# Altium schematic sheet triboard-tc3x7-extension.SchDoc: Extension Board for TriBoard TC3X7 V2.0
size A4 portrait; DrawnBy: Dwayne Herzberg; Revision: V0.1; SheetNumber: 1; SheetTotal: 1
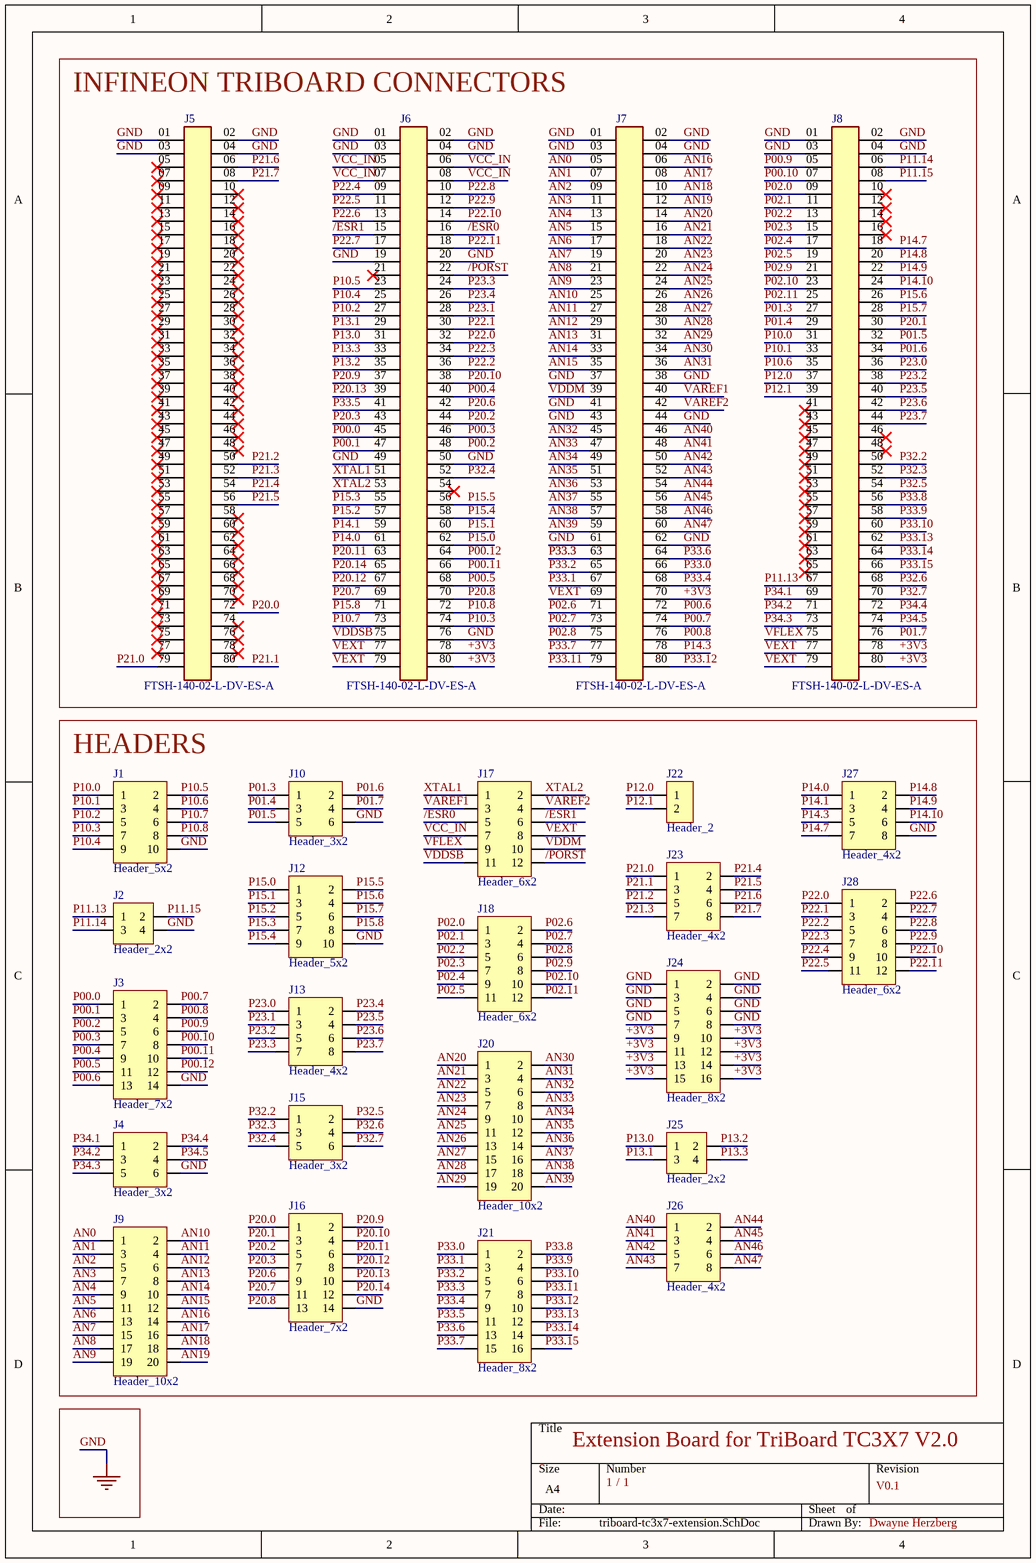
[diagram p0: triboard-tc3x7-extension.SchDoc]

## Parts
J1  Header_5x2  [header_5x2]
J2  Header_2x2  [Header_2x2]
J3  Header_7x2  [header_7x2]
J4  Header_3x2  [Header_3x2]
J5  FTSH-140-02-L-DV-ES-A  [SAMTEC_FTSH-140-XX-XXX-DV-ES-A]
J6  FTSH-140-02-L-DV-ES-A  [SAMTEC_FTSH-140-XX-XXX-DV-ES-A]
J7  FTSH-140-02-L-DV-ES-A  [SAMTEC_FTSH-140-XX-XXX-DV-ES-A]
J8  FTSH-140-02-L-DV-ES-A  [SAMTEC_FTSH-140-XX-XXX-DV-ES-A]
J9  Header_10x2  [Header_10x2]
J10  Header_3x2  [Header_3x2]
J12  Header_5x2  [header_5x2]
J13  Header_4x2  [header_4x2]
J15  Header_3x2  [Header_3x2]
J16  Header_7x2  [header_7x2]
J17  Header_6x2  [header_6x2]
J18  Header_6x2  [header_6x2]
J20  Header_10x2  [Header_10x2]
J21  Header_8x2  [header_8x2]
J22  Header_2  [HEADER_2]
J23  Header_4x2  [header_4x2]
J24  Header_8x2  [header_8x2]
J25  Header_2x2  [Header_2x2]
J26  Header_4x2  [header_4x2]
J27  Header_4x2  [header_4x2]
J28  Header_6x2  [header_6x2]

## Blocks framed on the sheet
INFINEON TRIBOARD CONNECTORS: J5-J8
HEADERS: J1-J4 J9 J10 J12 J13 J15-J18 J20-J28

## Nets
GND: J1.10 J2.4 J3.14 J4.6 J5.01 J5.02 J5.03 J5.04 J6.01 J6.02 J6.03 J6.04 J6.19 J6.20 J6.49 J6.50 J6.76 J7.01 J7.02 J7.03 J7.04 J7.37 J7.38 J7.41 J7.43 J7.44 J7.61 J7.62 J8.01 J8.02 J8.03 J8.04 J10.6 J12.10 J16.14 J24.1 J24.2 J24.3 J24.4 J24.5 J24.6 J24.7 J24.8 J27.8
+3V3: J6.78 J6.80 J7.70 J8.78 J8.80 J24.9 J24.10 J24.11 J24.12 J24.13 J24.14 J24.15 J24.16
/ESR0: J6.16 J17.5
/ESR1: J6.15 J17.6
/PORST: J6.22 J17.12
AN0: J7.05 J9.1
AN1: J7.07 J9.3
AN2: J7.09 J9.5
AN3: J7.11 J9.7
AN4: J7.13 J9.9
AN5: J7.15 J9.11
AN6: J7.17 J9.13
AN7: J7.19 J9.15
AN8: J7.21 J9.17
AN9: J7.23 J9.19
AN10: J7.25 J9.2
AN11: J7.27 J9.4
AN12: J7.29 J9.6
AN13: J7.31 J9.8
AN14: J7.33 J9.10
AN15: J7.35 J9.12
AN16: J7.06 J9.14
AN17: J7.08 J9.16
AN18: J7.10 J9.18
AN19: J7.12 J9.20
AN20: J7.14 J20.1
AN21: J7.16 J20.3
AN22: J7.18 J20.5
AN23: J7.20 J20.7
AN24: J7.22 J20.9
AN25: J7.24 J20.11
AN26: J7.26 J20.13
AN27: J7.28 J20.15
AN28: J7.30 J20.17
AN29: J7.32 J20.19
AN30: J7.34 J20.2
AN31: J7.36 J20.4
AN32: J7.45 J20.6
AN33: J7.47 J20.8
AN34: J7.49 J20.10
AN35: J7.51 J20.12
AN36: J7.53 J20.14
AN37: J7.55 J20.16
AN38: J7.57 J20.18
AN39: J7.59 J20.20
AN40: J7.46 J26.1
AN41: J7.48 J26.3
AN42: J7.50 J26.5
AN43: J7.52 J26.7
AN44: J7.54 J26.2
AN45: J7.56 J26.4
AN46: J7.58 J26.6
AN47: J7.60 J26.8
P00.0: J3.1 J6.45
P00.1: J3.3 J6.47
P00.2: J3.5 J6.48
P00.3: J3.7 J6.46
P00.4: J3.9 J6.40
P00.5: J3.11 J6.68
P00.6: J3.13 J7.72
P00.7: J3.2 J7.74
P00.8: J3.4 J7.76
P00.9: J3.6 J8.05
P00.10: J3.8 J8.07
P00.11: J3.10 J6.66
P00.12: J3.12 J6.64
P01.3: J8.27 J10.1
P01.4: J8.29 J10.3
P01.5: J8.32 J10.5
P01.6: J8.34 J10.2
P01.7: J8.76 J10.4
P02.0: J8.09 J18.1
P02.1: J8.11 J18.3
P02.2: J8.13 J18.5
P02.3: J8.15 J18.7
P02.4: J8.17 J18.9
P02.5: J8.19 J18.11
P02.6: J7.71 J18.2
P02.7: J7.73 J18.4
P02.8: J7.75 J18.6
P02.9: J8.21 J18.8
P02.10: J8.23 J18.10
P02.11: J8.25 J18.12
P10.0: J1.1 J8.31
P10.1: J1.3 J8.33
P10.2: J1.5 J6.27
P10.3: J1.7 J6.74
P10.4: J1.9 J6.25
P10.5: J1.2 J6.23
P10.6: J1.4 J8.35
P10.7: J1.6 J6.73
P10.8: J1.8 J6.72
P11.13: J2.1 J8.67
P11.14: J2.3 J8.06
P11.15: J2.2 J8.08
P12.0: J8.37 J22.1
P12.1: J8.39 J22.2
P13.0: J6.31 J25.1
P13.1: J6.29 J25.3
P13.2: J6.35 J25.2
P13.3: J6.33 J25.4
P14.0: J6.61 J27.1
P14.1: J6.59 J27.3
P14.3: J7.78 J27.5
P14.7: J8.18 J27.7
P14.8: J8.20 J27.2
P14.9: J8.22 J27.4
P14.10: J8.24 J27.6
P15.0: J6.62 J12.1
P15.1: J6.60 J12.3
P15.2: J6.57 J12.5
P15.3: J6.55 J12.7
P15.4: J6.58 J12.9
P15.5: J6.56 J12.2
P15.6: J8.26 J12.4
P15.7: J8.28 J12.6
P15.8: J6.71 J12.8
P20.0: J5.72 J16.1
P20.1: J8.30 J16.3
P20.2: J6.44 J16.5
P20.3: J6.43 J16.7
P20.6: J6.42 J16.9
P20.7: J6.69 J16.11
P20.8: J6.70 J16.13
P20.9: J6.37 J16.2
P20.10: J6.38 J16.4
P20.11: J6.63 J16.6
P20.12: J6.67 J16.8
P20.13: J6.39 J16.10
P20.14: J6.65 J16.12
P21.0: J5.79 J23.1
P21.1: J5.80 J23.3
P21.2: J5.50 J23.5
P21.3: J5.52 J23.7
P21.4: J5.54 J23.2
P21.5: J5.56 J23.4
P21.6: J5.06 J23.6
P21.7: J5.08 J23.8
P22.0: J6.32 J28.1
P22.1: J6.30 J28.3
P22.2: J6.36 J28.5
P22.3: J6.34 J28.7
P22.4: J6.09 J28.9
P22.5: J6.11 J28.11
P22.6: J6.13 J28.2
P22.7: J6.17 J28.4
P22.8: J6.10 J28.6
P22.9: J6.12 J28.8
P22.10: J6.14 J28.10
P22.11: J6.18 J28.12
P23.0: J8.36 J13.1
P23.1: J6.28 J13.3
P23.2: J8.38 J13.5
P23.3: J6.24 J13.7
P23.4: J6.26 J13.2
P23.5: J8.40 J13.4
P23.6: J8.42 J13.6
P23.7: J8.44 J13.8
P32.2: J8.50 J15.1
P32.3: J8.52 J15.3
P32.4: J6.52 J15.5
P32.5: J8.54 J15.2
P32.6: J8.68 J15.4
P32.7: J8.70 J15.6
P33.0: J7.66 J21.1
P33.1: J7.67 J21.3
P33.2: J7.65 J21.5
P33.3: J7.63 J21.7
P33.4: J7.68 J21.9
P33.5: J6.41 J21.11
P33.6: J7.64 J21.13
P33.7: J7.77 J21.15
P33.8: J8.56 J21.2
P33.9: J8.58 J21.4
P33.10: J8.60 J21.6
P33.11: J7.79 J21.8
P33.12: J7.80 J21.10
P33.13: J8.62 J21.12
P33.14: J8.64 J21.14
P33.15: J8.66 J21.16
P34.1: J4.1 J8.69
P34.2: J4.3 J8.71
P34.3: J4.5 J8.73
P34.4: J4.2 J8.72
P34.5: J4.4 J8.74
VAREF1: J7.40 J17.3
VAREF2: J7.42 J17.4
VCC_IN: J6.05 J6.06 J6.07 J6.08 J17.7
VDDM: J7.39 J17.10
VDDSB: J6.75 J17.11
VEXT: J6.77 J6.79 J7.69 J8.77 J8.79 J17.8
VFLEX: J8.75 J17.9
XTAL1: J6.51 J17.1
XTAL2: J6.53 J17.2

Not connected (* = marked no-connect by the designer): J5 05* 07* 09* 10* 11* 12* 13* 14* 15* 16* 17* 18* 19* 20* 21* 22* 23* 24* 25* 26* 27* 28* 29* 30* 31* 32* 33* 34* 35* 36* 37* 38* 39* 40* 41* 42* 43* 44* 45* 46* 47* 48* 49* 51* 53* 55* 57* 58* 59* 60* 61* 62* 63* 64* 65* 66* 67* 68* 69* 70* 71* 73* 74* 75* 76* 77* 78*; J6 21* 54*; J8 10* 12* 14* 16* 41* 43* 45* 46* 47* 48* 49* 51* 53* 55* 57* 59* 61* 63* 65*

## Notes on the sheet
- /

## Library data of the parts
J5-J8 = FTSH-140-02-L-DV-ES-A: Board Connector; Manufacturer: Samtec; Supplier: Digikey; Supplier Part Number: SAM9464-ND; Manufacturer Part Number: FTSH-140-02-L-DV-ES-A; RoHS: Yes; Category: Headers and Wire Housings; Stock: 78; Pricing: 1=9,65, 10=9,348, 25=9,0468, 50=8,4226, 100=7,1666 (USD); Contact Finish - Termination: MATTE TIN; Contact Material: Bronze; Contact Finish - Mating: GOLD (10); Connector Type: BOARD CONNECTOR; JESD-609 Code: e3; RoHS Compliant: Yes; Reach SVHC Compliant: No; ComponentLink1URL: https://datasheet.ciiva.com:443/pdfs/VipMasterIC/IC/SAMI/SAMI-S-A0005694125/SAMI-S-A0005694125-1.pdf?src-supplier=IHS+Markit; ComponentLink1Description: https://datasheet.ciiva.com:443/pdfs/VipMasterIC/IC/SAMI/SAMI-S-A0005694125/SAMI-S-A0005694125-1.pdf?src-supplier=IHS+Markit; ComponentLink2URL: https://datasheet.ciiva.com/9623/ftsh-mt-9623839.pdf?src-supplier=Avnet; ComponentLink2Description: https://datasheet.ciiva.com/9623/ftsh-mt-9623839.pdf?src-supplier=Avnet